# Altium schematic sheet Filtro&Fonte.SchDoc
size A4
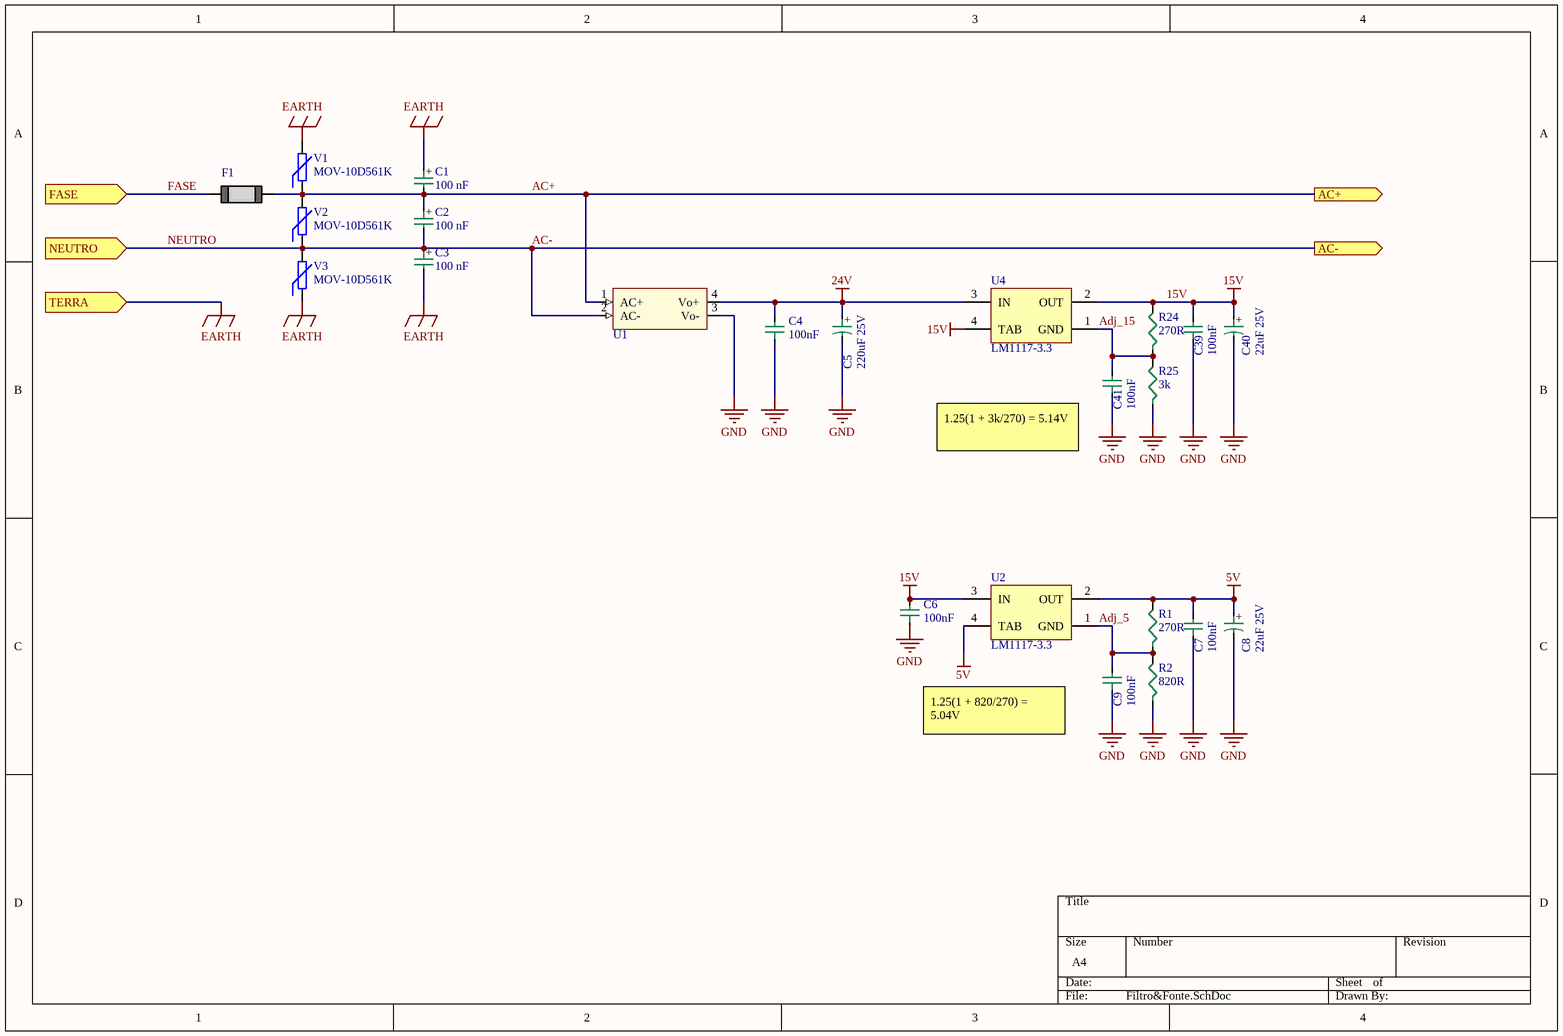
[diagram p0: Filtro&Fonte.SchDoc]

## Parts
C1  value 100 nF  [CAP FILM 10 mm Lead]  (hidden comment: Cap Film 22.5mm)
C2  value 100 nF  [CAP FILM 10 mm Lead]  (hidden comment: Cap Film 22.5mm)
C3  value 100 nF  [CAP FILM 10 mm Lead]  (hidden comment: Cap Film 22.5mm)
C4  value 100nF  [0805C]  (hidden comment: 0805)
C5  value 220uF 25V  [CAP SMD D8.0 A10.2]  (hidden comment: D8.0 A10.2)
C6  value 100nF  [0805C]  (hidden comment: 0805)
C7  value 100nF  [0805C]  (hidden comment: 0805)
C8  value 22uF 25V  [CAP SMD D5.0 A5.4]  (hidden comment: D5.0 A5.4)
C9  value 100nF  [0805C]  (hidden comment: 0805)
C39  value 100nF  [0805C]  (hidden comment: 0805)
C40  value 22uF 25V  [CAP SMD D5.0 A5.4]  (hidden comment: D5.0 A5.4)
C41  value 100nF  [0805C]  (hidden comment: 0805)
F1  5 x 20 mm  [Fuseholder 5 x 20 mm]  (value not drawn)
R1  value 270R  [0805]  (hidden comment: 0805)
R2  value 820R  [0805]  (hidden comment: 0805)
R24  value 270R  [0805]  (hidden comment: 0805)
R25  value 3k  [0805]  (hidden comment: 0805)
U1  5V supply*  [HILINK]  (value not drawn)
U2  LM1117-3.3  [LM1117]
U4  LM1117-3.3  [LM1117]
V1  MOV-10D561K  [VARISTOR 7.5mm]
V2  MOV-10D561K  [VARISTOR 7.5mm]
V3  MOV-10D561K  [VARISTOR 7.5mm]

## Ports
AC+ (out), AC- (out), FASE (in), NEUTRO (in), TERRA (in)

## Nets
5V: C7.2 C8.1 R1.2 U2.2(OUT) U2.4(TAB)
15V: C6.2 C39.2 C40.1 R24.2 U2.3(IN) U4.2(OUT) U4.4(TAB)
24V: C4.2 C5.1 U1.4(Vo+) U4.3(IN)
EARTH: C1.1 C3.2 V1.2 V3.1 ; port TERRA
GND: C4.1 C5.2 C6.1 C7.1 C8.2 C9.1 C39.1 C40.2 C41.1 R2.1 R25.1 U1.3(Vo-)
AC+: C1.2 C2.1 F1.1 U1.1(AC+) V1.1 V2.2 ; port AC+
AC-: C2.2 C3.1 U1.2(AC-) V2.1 V3.2 ; port AC-, port NEUTRO  [also labelled NEUTRO]
Adj_5: C9.2 R1.1 R2.2 U2.1(GND)
Adj_15: C41.2 R24.1 R25.2 U4.1(GND)
FASE: F1.2 ; port FASE

## Notes on the sheet
- (near C41) 1.25(1 + 3k/270) = 5.14V
- 1.25(1 + 820/270) = 5.04V
- (in symbol Capacitor FILM 100nF 275 VAc) +
- (in symbol Capacitor SMD D5.0 A5.4) +
- (in symbol Capacitor SMD D8.0 A10.2) +

## Library data of the parts
C1-C3 = Capacitor FILM 100nF 275 VAc: Safety Capacitors 275VAC 0.1uF 10% LS 10mm X2; %: ±20%; Tensão: 200V; ComponentLink1Description: Mouser; ComponentLink1URL: https://www.mouser.com/ProductDetail/EPCOS-TDK/B32921Y2104K000?qs=TuK3vfAjtkXr4SycMmru8w%3D%3D
C4 C6 C7 C9 C39 C41 = Capacitor SMD 0805
C5 = Capacitor SMD D8.0 A10.2: %: ±20%
C8 C40 = Capacitor SMD D5.0 A5.4: %: ±20%
F1 = FuseHolder 5 x 20 mm: Fuseholder Open Design, 5 x 20 mm; Tensão: 500 VA; Corrente: 16A; DataSheet: https://br.mouser.com/datasheet/2/358/typ_OGN-14523.pdf; 3D Model: https://www.3dcontentcentral.com/secure/download-model.aspx?catalogid=171&id=541358
R1 R2 R24 R25 = Resistor SMD 0805 1/8 W: %: ±1%; P: 1/8W
U1 = HI-LINK PM01 3W: 5V 3W Ultra-small Power Module PM03; ComponentLink1Description: datasheet; ComponentLink1URL: https://datasheet.lcsc.com/szlcsc/1909111105_HI-LINK-HLK-PM24_C399250.pdf
U2 U4 = LM1117IMP-3.3: CI Regulador LM1117IMP-3.3 800mA Low-Dropout Linear Regulator, 4-pin SOT-223; Manufacturer: National Semiconductor; PackageTopMarking: XYTT*N05B; PowerWise: N; CompType: LDO IC; Published: 4-Dec-2008; DatasheetVersion: Apr-2006; PackageVersion: revB, Apr-2003; PackageReference: MP04A; Publisher: Altium Limited; PackageDescription: Molded SOT-223, 6.50 x 3.56 x 1.6mm Body, 4 Lead, 2.3mm Pitch; Supplier 1: Farnell; Supplier Part Number 1: 7614123; PartNumber: LM1117IMP-3.3; RoHS: N; PinCount: 4; Code_JEDEC: TO-261-AA; Code_IPC: SOT223-4; ComponentLink1Description: LM1117 Datasheet; ComponentLink1URL: http://www.national.com/ds/LM/LM1117.pdf; ComponentLink2Description: LM1117 Web Page; ComponentLink2URL: http://www.national.com/pf/LM/LM1117.html; ComponentLink3Description: MP04A Package Page; ComponentLink3URL: http://www.national.com/packaging/folders/mp04a.html
V1-V3 = Varistor: Varistors 180pF 560volts 10%; ComponentLink1Description: MOUSER; ComponentLink1URL: https://www.mouser.com/ProductDetail/Bourns/MOV-10D561K?qs=lgttKnAd%252B2ArrqGQgWwr6w%3D%3D